# EAGLE schematic Pontos Cegos (EAGLE 7.3.0)
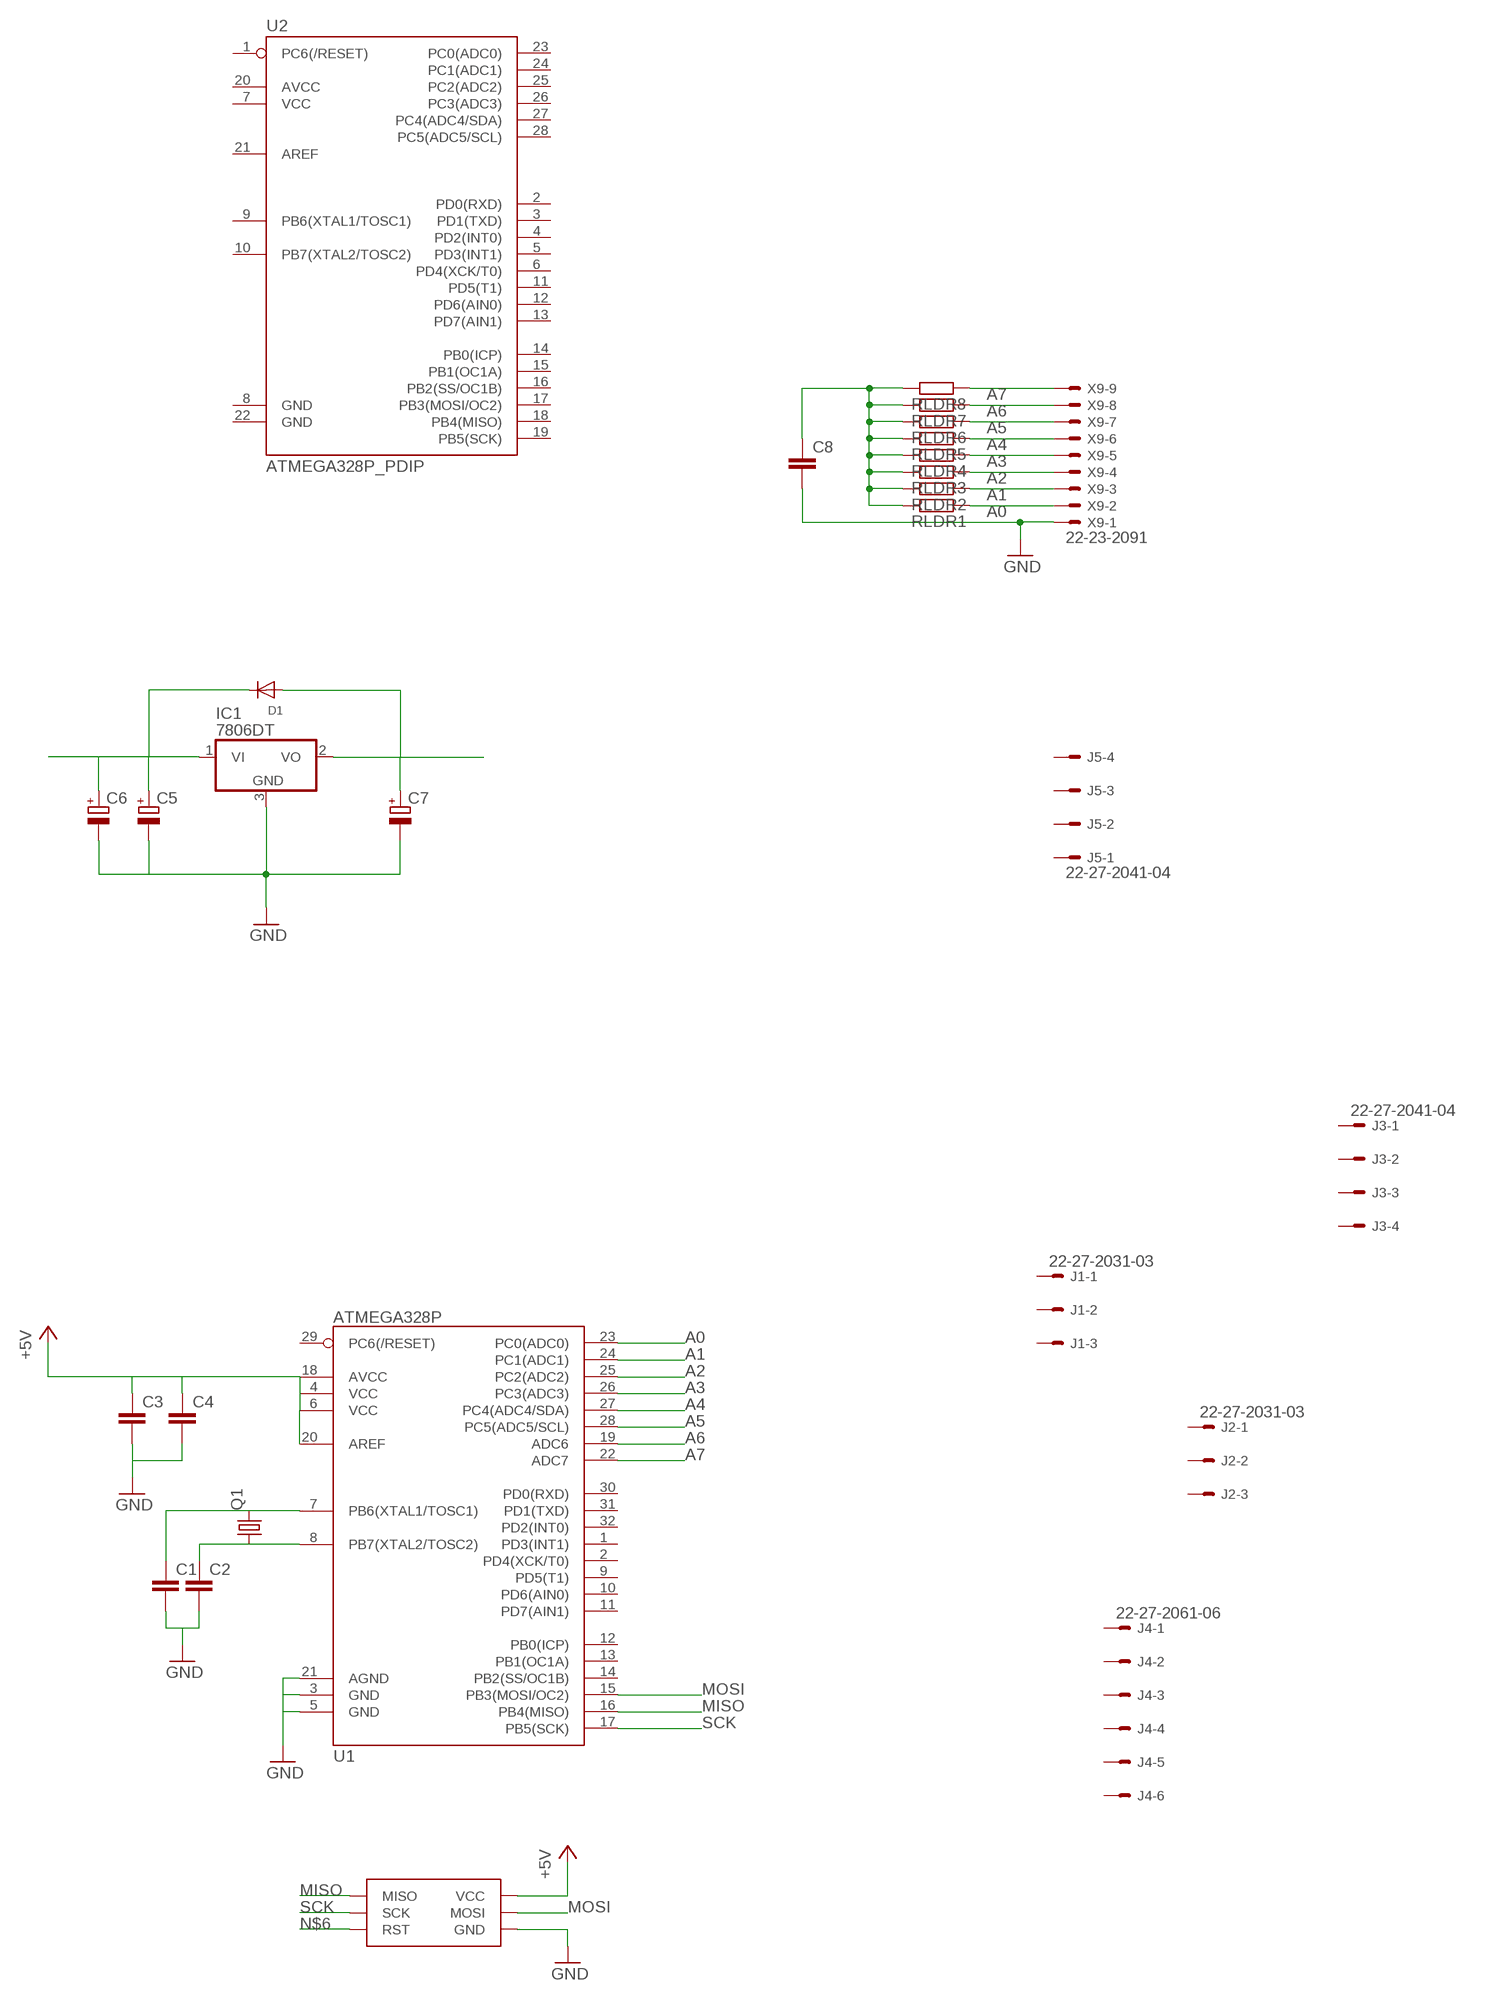
[diagram p0: schematic, sheet 1]

## Parts
C1  C-EUC0805  [C0805]
C2  C-EUC0805  [C0805]
C3  C-EUC0805  [C0805]
C4  C-EUC0805  [C0805]
C5  CPOL-EUD  [PANASONIC_D]
C6  CPOL-EUD  [PANASONIC_D]
C7  CPOL-EUD  [PANASONIC_D]
C8  C-EUC0805  [C0805]
D1  DIODESMA  [SMADIODE]
IC1  7806DT  [TO252]
J1  22-27-2031-03  [6410-03]
J2  22-27-2031-03  [6410-03]
J3  22-27-2041-04  [6410-04]
J4  22-27-2061-06  [6410-06]
J5  22-27-2041-04  [6410-04]
Q1  CRYSTALHC49U-V  [HC49U-V]
RLDR1  R-EU_R0603  [R0603]
RLDR2  R-EU_R0603  [R0603]
RLDR3  R-EU_R0603  [R0603]
RLDR4  R-EU_R0603  [R0603]
RLDR5  R-EU_R0603  [R0603]
RLDR6  R-EU_R0603  [R0603]
RLDR7  R-EU_R0603  [R0603]
RLDR8  R-EU_R0603  [R0603]
U1  ATMEGA328P  ATMEGA328_SMT  [TQFP32-08]
U2  ATMEGA328P_PDIP  [DIL28-3]
U$1  ISP_POGOISP_POGO  [ISP_POGO]
X9  22-23-2091  [22-23-2091]

## Nets
+5V: C3.1 C4.1 C8.1 RLDR1.1 RLDR2.1 RLDR3.1 RLDR4.1 RLDR5.1 RLDR6.1 RLDR7.1 RLDR8.1 U1.4(VCC) U1.6(VCC) U1.18(AVCC) U1.20(AREF) U$1.VCC
A0: RLDR1.2 U1.23(PC0(ADC0)) X9.2
A1: RLDR2.2 U1.24(PC1(ADC1)) X9.3
A2: RLDR3.2 U1.25(PC2(ADC2)) X9.4
A3: RLDR4.2 U1.26(PC3(ADC3)) X9.5
A4: RLDR5.2 U1.27(PC4(ADC4/SDA)) X9.6
A5: RLDR6.2 U1.28(PC5(ADC5/SCL)) X9.7
A6: RLDR7.2 U1.19(ADC6) X9.8
A7: RLDR8.2 U1.22(ADC7) X9.9
GND: C1.2 C2.2 C3.2 C4.2 C5.- C6.- C7.- C8.2 IC1.3(GND) U1.3(GND) U1.5(GND) U1.21(AGND) U$1.GND X9.1
MISO: U1.16(PB4(MISO)) U$1.MISO
MOSI: U1.15(PB3(MOSI/OC2)) U$1.MOSI
N$1: C1.1 Q1.2 U1.7(PB6(XTAL1/TOSC1))
N$2: C2.1 Q1.1 U1.8(PB7(XTAL2/TOSC2))
N$6: U$1.RST
N$13: C5.+ C6.+ D1.C IC1.1(VI)
N$14: C7.+ D1.A IC1.2(VO)
SCK: U1.17(PB5(SCK)) U$1.SCK
Unconnected: J1.1 J1.2 J1.3 J2.1 J2.2 J2.3 J3.1 J3.2 J3.3 J3.4 J4.1 J4.2 J4.3 J4.4 J4.5 J4.6 J5.1 J5.2 J5.3 J5.4 U1.1(PD3(INT1)) U1.2(PD4(XCK/T0)) U1.9(PD5(T1)) U1.10(PD6(AIN0)) U1.11(PD7(AIN1)) U1.12(PB0(ICP)) U1.13(PB1(OC1A)) U1.14(PB2(SS/OC1B)) U1.29(PC6(/RESET)) U1.30(PD0(RXD)) U1.31(PD1(TXD)) U1.32(PD2(INT0)) U2.1(PC6(/RESET)) U2.2(PD0(RXD)) U2.3(PD1(TXD)) U2.4(PD2(INT0)) U2.5(PD3(INT1)) U2.6(PD4(XCK/T0)) U2.7(VCC) U2.8(GND) U2.9(PB6(XTAL1/TOSC1)) U2.10(PB7(XTAL2/TOSC2)) U2.11(PD5(T1)) U2.12(PD6(AIN0)) U2.13(PD7(AIN1)) U2.14(PB0(ICP)) U2.15(PB1(OC1A)) U2.16(PB2(SS/OC1B)) U2.17(PB3(MOSI/OC2)) U2.18(PB4(MISO)) U2.19(PB5(SCK)) U2.20(AVCC) U2.21(AREF) U2.22(GND) U2.23(PC0(ADC0)) U2.24(PC1(ADC1)) U2.25(PC2(ADC2)) U2.26(PC3(ADC3)) U2.27(PC4(ADC4/SDA)) U2.28(PC5(ADC5/SCL))

## Library data of the parts
C1-C4 C8 = wes:C-EU: CAPACITOR, European symbol
C5-C7 = rcl:CPOL-EU: POLARIZED CAPACITOR, European symbol
D1 = adafruit:DIODE: Diode SMADIODE - SMA Surface Mount Package 20V 1A Schottky Diode Digikey: 641-1014-6-ND DO-1N4148 - Through Hole Small Current Diode SOD-123 20V 1 A (.5mV Vf) Schottky Diode - Digikey: MBRX120TPMSCT-ND SOD-323 10V 570mA (.38mV Vf, 3ns) Schottky Diode - Digikey: ZLLS410CT-ND SOD-523 30V 30mA Schottky Diode (RB751S-40TE61) - Digikey: RB751S-40TE61CT-ND SOT23-R/W - SOT23 Package (R = Solder Paste/Reflow Ovens, W = Hand-Soldering) BAT54Film 40V 300mA - Digikey: 497-7162-1-ND
IC1 = linear:78*: Positive VOLTAGE REGULATOR Source: http://cache.national.com/ds/LM/LM78L05.pdf http://www.fairchildsemi.com/ds/LM/LM7805.pdf
J1 J2 = con-molex:22-?-03: CONNECTOR wire to board 2.54 mm (.1 inch) pitch header; OC_FARNELL: unknown; OC_NEWARK: unknown
J3 J5 = con-molex:22-?-04: CONNECTOR wire to board 2.54 mm (.1 inch) pitch header; OC_FARNELL: unknown; OC_NEWARK: unknown
J4 = con-molex:22-?-06: CONNECTOR wire to board 2.54 mm (.1 inch) pitch header; OC_FARNELL: unknown; OC_NEWARK: unknown
Q1 = crystal:CRYSTAL: CRYSTAL; OC_FARNELL: 1666969; OC_NEWARK: unknown
RLDR1-RLDR8 = wes:R-EU_: RESISTOR, European symbol
U1 = SparkFun-DigitalIC:ATMEGA328_SMT: 32-Pin Atmega328 part Commonly used on Arduino compatible boards Available in QFP and QFN packages TQFP is IC-09069 QFN is non-stock; PROD_ID: IC-09069
U2 = SparkFun-DigitalIC:ATMEGA328P_PDIP: uC used in the Arduino 32kb flash, 1k EEPROM, 2k SRAM This is the through-hole version of this chip.
U$1 = wes:ISP_POGO
X9 = con-molex:22-23-2091: .100" (2.54mm) Center Header - 9 Pin; MF: MOLEX; MPN: 22-23-2091; OC_FARNELL: 1756827; OC_NEWARK: 56H0450